# Altium schematic sheet PFC_CurrentSensor_v3.SchDoc
size A4
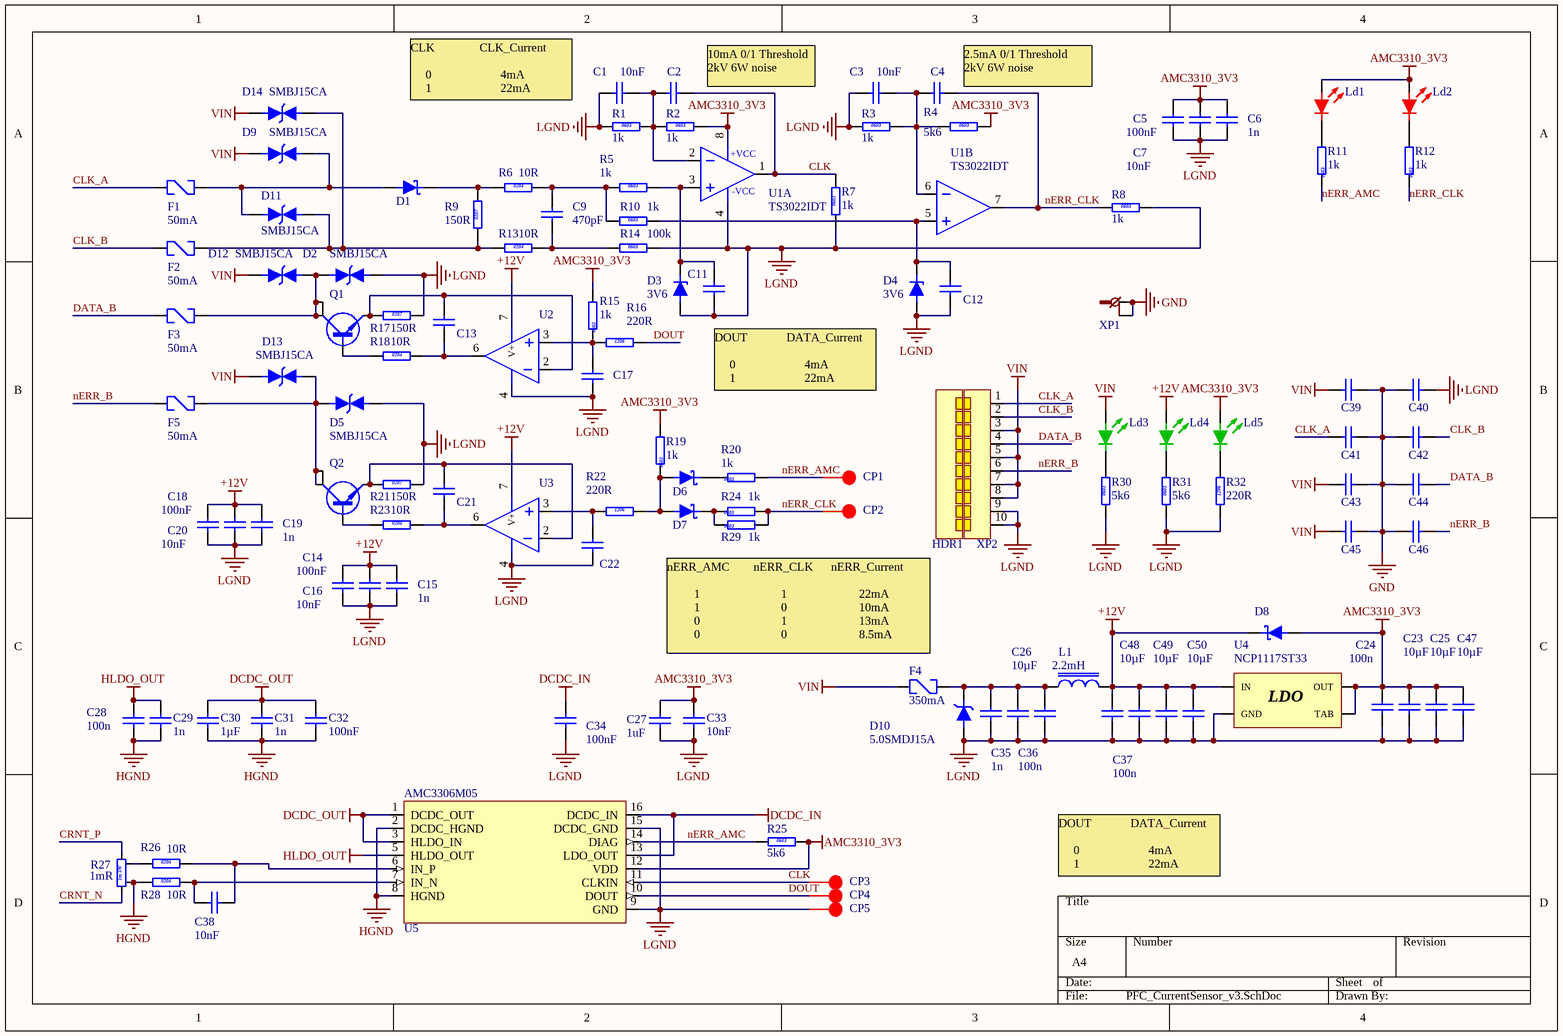
[diagram p0: PFC_CurrentSensor_v3.SchDoc]

## Parts
C1  10nF  [CAP1206]
C2  100p/100V/0603  [CAP0603]  (value not drawn)
C3  10nF  [CAP1206]
C4  100p/100V/0603  [CAP0603]  (value not drawn)
C5  100nF  [CAP1206]
C6  1n  [CAP0603]
C7  10nF  [CAP1206]
C9  470pF  [CAP1206]
C11  100p/100V/0603  [CAP0603]  (value not drawn)
C12  100p/100V/0603  [CAP0603]  (value not drawn)
C13  100p/100V/0603  [CAP0603]  (value not drawn)
C14  100nF  [CAP1206]
C15  1n  [CAP0603]
C16  10nF  [CAP1206]
C17  100p/100V/0603  [CAP0603]  (value not drawn)
C18  100nF  [CAP1206]
C19  1n  [CAP0603]
C20  10nF  [CAP1206]
C21  100p/100V/0603  [CAP0603]  (value not drawn)
C22  100p/100V/0603  [CAP0603]  (value not drawn)
C23  10µF  [CAP1210]
C24  100n  [CAP1812]
C25  10µF  [CAP1210]
C26  10µF  [CAP1210]
C27  1uF  [CAP1206]
C28  100n  [CAP1812]
C29  1n  [CAP1812]
C30  1µF  [CAP0603]
C31  1n  [CAP0603]
C32  100nF  [CAP0603]
C33  10nF  [CAP1206]
C34  100nF  [CAP0603]
C35  1n  [CAP1812]
C36  100n  [CAP1812]
C37  100n  [CAP1812]
C38  10nF  [CAP1206]
C39  470p/1kV/1812/C0G  [CAP1812]  (value not drawn)
C40  470p/1kV/1812/C0G  [CAP1812]  (value not drawn)
C41  470p/1kV/1812/C0G  [CAP1812]  (value not drawn)
C42  470p/1kV/1812/C0G  [CAP1812]  (value not drawn)
C43  470p/1kV/1812/C0G  [CAP1812]  (value not drawn)
C44  470p/1kV/1812/C0G  [CAP1812]  (value not drawn)
C45  470p/1kV/1812/C0G  [CAP1812]  (value not drawn)
C46  470p/1kV/1812/C0G  [CAP1812]  (value not drawn)
C47  10µF  [CAP1210]
C48  10µF  [CAP1210]
C49  10µF  [CAP1210]
C50  10µF  [CAP1210]
CP1  CONTROL PAD  [CONTROL PAD]  (value not drawn)
CP2  CONTROL PAD  [CONTROL PAD]  (value not drawn)
CP3  CONTROL PAD  [CONTROL PAD]  (value not drawn)
CP4  CONTROL PAD  [CONTROL PAD]  (value not drawn)
CP5  CONTROL PAD  [CONTROL PAD]  (value not drawn)
D1  B5819W/SOD123  [SOD123]  (value not drawn)
D2  SMBJ15CA  [SMB]
D3  3V6  [SMA]
D4  3V6  [SMA]
D5  SMBJ15CA  [SMB]
D6  B5819W/SOD123  [SOD123]  (value not drawn)
D7  B5819W/SOD123  [SOD123]  (value not drawn)
D8  B5819W/SOD123  [SOD123]  (value not drawn)
D9  SMBJ15CA  [SMB]
D10  5.0SMDJ15A  [SMC]
D11  SMBJ15CA  [SMB]
D12  SMBJ15CA  [SMB]
D13  SMBJ15CA  [SMB]
D14  SMBJ15CA  [SMB]
F1  50mA  [FUSE1206]
F2  50mA  [FUSE1206]
F3  50mA  [FUSE1206]
F4  350mA  [FUSE1206]
F5  50mA  [FUSE1206]
HDR1  2*5  [CON/MOLEX/2*5/2.00/FEMALE]  (value not drawn)
L1  2.2mH  [IND12.5X12.5MM]
Ld1  R/0603  [LED0603]  (value not drawn)
Ld2  R/0603  [LED0603]  (value not drawn)
Ld3  G/0603  [LED0603]  (value not drawn)
Ld4  G/0603  [LED0603]  (value not drawn)
Ld5  G/0603  [LED0603]  (value not drawn)
Q1  BCP56/SOT223L  [SOT223L]  (value not drawn)
Q2  BCP56/SOT223L  [SOT223L]  (value not drawn)
R1  1k  [RES0603]
R2  1k  [RES0603]
R3  1k  [RES0603]
R4  5k6  [RES0603]
R5  1k  [RES0603]
R6  10R  [MELF-0204]
R7  1k  [RES0603]
R8  1k  [RES0603]
R9  150R  [MELF-0207]
R10  1k  [RES0603]
R11  1k  [RES0603]
R12  1k  [RES0603]
R13  10R  [MELF-0204]
R14  100k  [RES0603]
R15  1k  [RES0603]
R16  220R  [RES1206]
R17  150R  [MELF-0207]
R18  10R  [MELF-0204]
R19  1k  [RES0603]
R20  1k  [RES0603]
R21  150R  [MELF-0207]
R22  220R  [RES1206]
R23  10R  [MELF-0204]
R24  1k  [RES0603]
R25  5k6  [RES0603]
R26  10R  [MELF-0204]
R27  1mR  [RES-5W-4terminals_CurrensSense]
R28  10R  [MELF-0204]
R29  1k  [RES0603]
R30  5k6  [RES0603]
R31  5k6  [RES0603]
R32  220R  [RES1206]
TRML1  CON/MOLEX/2*5/2.00/TERMILAL  [CON/MOLEX/2*5/2.00/TERMILAL]  (value not drawn)
TRML2  CON/MOLEX/2*5/2.00/TERMILAL  [CON/MOLEX/2*5/2.00/TERMILAL]  (value not drawn)
TRML3  CON/MOLEX/2*5/2.00/TERMILAL  [CON/MOLEX/2*5/2.00/TERMILAL]  (value not drawn)
TRML4  CON/MOLEX/2*5/2.00/TERMILAL  [CON/MOLEX/2*5/2.00/TERMILAL]  (value not drawn)
TRML5  CON/MOLEX/2*5/2.00/TERMILAL  [CON/MOLEX/2*5/2.00/TERMILAL]  (value not drawn)
TRML6  CON/MOLEX/2*5/2.00/TERMILAL  [CON/MOLEX/2*5/2.00/TERMILAL]  (value not drawn)
TRML7  CON/MOLEX/2*5/2.00/TERMILAL  [CON/MOLEX/2*5/2.00/TERMILAL]  (value not drawn)
TRML8  CON/MOLEX/2*5/2.00/TERMILAL  [CON/MOLEX/2*5/2.00/TERMILAL]  (value not drawn)
TRML9  CON/MOLEX/2*5/2.00/TERMILAL  [CON/MOLEX/2*5/2.00/TERMILAL]  (value not drawn)
TRML10  CON/MOLEX/2*5/2.00/TERMILAL  [CON/MOLEX/2*5/2.00/TERMILAL]  (value not drawn)
U1  TS3022IDT  [SO8_N]  (parts A,B of 2)
U2  TLV197QDGKRQ1  [MS-8]  (value not drawn)
U3  TLV197QDGKRQ1  [MS-8]  (value not drawn)
U4  NCP1117ST33  [SOT223L]
U5  AMC3306M05  [SOIC-16W]
XP1  CON/1*1/5mm/M/Faston  [LS1560]  (value not drawn)
XP2  2*5  [CON/MOLEX/2*5/2.00/SMT_MALE]  (value not drawn)

## Nets
+12V: C14.1 C15.1 C16.2 C18.1 C19.1 C20.2 C37.1 C48.1 C49.1 C50.1 D8.2(C) L1.2 Ld4.1 U2.7(V+) U3.7(V+) U4.3(IN)
AMC3310_3V3: C5.1 C6.1 C7.2 C23.1 C24.1 C25.1 C27.1 C33.1 C47.1 D8.1(A) Ld1.1 Ld2.1 Ld5.1 R2.1 R4.1 R15.1 R19.1 R25.1 U1.8(V+) U4.2(OUT) U4.4(TAB) U5.12(VDD)
DCDC_IN: C34.2 U5.13(LDO_OUT) U5.16(DCDC_IN)
DCDC_OUT: C30.1 C31.1 C32.2 U5.1(DCDC_OUT) U5.3(HLDO_IN)
GND: C39.2 C40.1 C41.2 C42.1 C43.2 C44.1 C45.2 C46.1 XP1.1(P$1) XP1.1A(P$2)
HGND: C28.2 C29.2 C30.2 C31.2 C32.1 R27.2(S1) R28.2 U5.2(DCDC_HGND) U5.8(HGND)
HLDO_OUT: C28.1 C29.1 U5.5(HLDO_OUT)
LGND: C1.2 C3.2 C5.2 C6.2 C7.1 C11.1 C12.1 C14.2 C15.2 C16.1 C17.2 C18.2 C19.2 C20.1 C22.2 C23.2 C24.2 C25.2 C26.2 C27.2 C33.2 C34.1 C35.2 C36.2 C37.2 C40.2 C47.2 C48.2 C49.2 C50.2 CP5.1 D2.1(A) D3.1(A) D4.1(A) D5.1(A) D10.1(A) R1.2 R3.2 R7.2 R8.1 R14.1 R17.1 R21.1 R30.2 R31.2 R32.2 U1.4(V-) U2.4(Vee) U3.4(Vee) U4.1(GND) U5.9(GND) U5.15(DCDC_GND) XP2.9 XP2.10
VIN: C39.1 C43.1 C45.1 D9.2(C) D12.1(A) D13.1(A) D14.2(C) F4.2 Ld3.1 XP2.3 XP2.5 XP2.7 XP2.8
CLK: C2.2 CP3.1 R7.1 U1.1(OUT1) U5.11(CLKIN)
CLK_A: C41.1 F1.2 XP2.1
CLK_B: C42.2 F2.2 XP2.2
CRNT_N: R27.1(C1)
CRNT_P: R27.4(C2)
DATA_B: C44.2 F3.2 XP2.4
DOUT: CP4.1 R16.1 U5.10(DOUT)
nERR_AMC: CP1.1 R11.2 R20.1 R25.2 U5.14(DIAG)
nERR_B: C46.2 F5.2 XP2.6
nERR_CLK: C4.2 CP2.1 R8.2 R12.2 R24.1 R29.1 U1.7(OUT2)
NetC1_1: C1.1 C2.1 R1.1 R2.2 U1.2(IN-1)
NetC3_1: C3.1 C4.1 R3.1 R4.2 U1.6(IN-2)
NetC9_1: C9.1 R5.2 R6.1 R10.2
NetC9_2: C9.2 R13.1 R14.2
NetC11_2: C11.2 D3.2(C) R5.1 U1.3(IN+1)
NetC12_2: C12.2 D4.2(C) R10.1 U1.5(IN+2)
NetC13_1: C13.1 R18.1 U2.6(OUT1)
NetC13_2: C13.2 Q1.3(E) R17.2 U2.2(IN-)
NetC17_1: C17.1 R15.2 R16.2 U2.3(IN+)
NetC21_1: C21.1 R23.1 U3.6(OUT1)
NetC21_2: C21.2 Q2.3(E) R21.2 U3.2(IN-)
NetC22_1: C22.1 R22.2 U3.3(IN+)
NetC26_1: C26.1 C35.1 C36.1 D10.2(C) F4.1 L1.1
NetC38_1: C38.1 R28.1 U5.7(IN_N)
NetC38_2: C38.2 R26.1 U5.6(IN_P)
NetD1_1: D1.1(A) D9.1(A) D11.2(C) F1.1
NetD1_2: D1.2(C) R6.2 R9.1
NetD2_2: D2.2(C) D12.2(C) F3.1 Q1.2(C) Q1.4(S)
NetD5_2: D5.2(C) D13.2(C) F5.1 Q2.2(C) Q2.4(S)
NetD6_1: D6.1(A) D7.1(A) R19.2 R22.1
NetD6_2: D6.2(C) R20.2
NetD7_2: D7.2(C) R24.2 R29.2
NetD11_1: D11.1(A) D14.1(A) F2.1 R9.2 R13.2
NetLd1_2: Ld1.2 R11.1
NetLd2_2: Ld2.2 R12.1
NetLd3_2: Ld3.2 R30.1
NetLd4_2: Ld4.2 R31.1
NetLd5_2: Ld5.2 R32.1
NetQ1_1: Q1.1(B) R18.2
NetQ2_1: Q2.1(B) R23.2
NetR26_2: R26.2 R27.3(S2)

## Notes on the sheet
- CLK               CLK_Current
  0                       4mA
  1                       22mA
- 10mA 0/1 Threshold
  2kV 6W noise
- (near C4) 2.5mA 0/1 Threshold
  2kV 6W noise
- DOUT             DATA_Current
  0                       4mA
  1                       22mA
- nERR_AMC        nERR_CLK      nERR_Current
  1                           1                        22mA
  1                           0                        10mA
  0                           1                        13mA
  0                           0                        8.5mA
- (in symbol Comp/TS3022/5V/38ns/SOIC-8, part A) +VCC; -VCC
- (in symbol LDO/NCP1117/3.3V/20V/1A/SOT223) LDO
- (in symbol R1m/5W/TH/4 Terminal) 1m 5W
- (in symbol R100/0.5%/0204) 0204
- (in symbol R102/0603) 0603
- (in symbol R104/0603) 0603
- (in symbol R151/0207) 0207
- (in symbol R221/1206) 1206
- (in symbol R562/0603) 0603

## Library data of the parts
C1 C3 C7 C16 C20 C33 C38 = C103/50V/1206: CAPACITOR UNPOLARIZED; Store D Other: lcsc C152841
C2 C4 C11-C13 C17 C21 C22 = C101/100V/0603: CAPACITOR UNPOLARIZED; Store B TME: C0603C101J1GAC; Store A Farnell: 1414602; Store C Mouser: 80-C0603C101J1G; Stock: ?
C5 C14 C18 = C104/50V/NP0/1206: CAPACITOR UNPOLARIZED; Store C Mouser: 810-C3216NP01H104J1A; Store D Other: *
C6 C15 C19 C31 = C102/25V/0603: CAPACITOR UNPOLARIZED; Store C Mouser: 80-C0603C102J3GAUTO; Stock: ?
C9 = C471/100V/1206/C0G: CAPACITOR UNPOLARIZED; Store A Farnell: 2320870; Store C Mouser: 710-885012008071; Stock: ?
C23 C25 C26 C47-C50 = C106/50V/1210: CAPACITOR UNPOLARIZED; Store B TME: C1210C106K5RAC; Store C Mouser: 80-C1210C106K5R; Stock: ?
C24 C28 C36 C37 = C104/1kV/1812: CAPACITOR UNPOLARIZED; Store D Other: lcsc C106147; Stock: ?
C27 = C105/100V/1206: CAPACITOR UNPOLARIZED; Store C Mouser: 80-C1206C105K1R
C29 C35 = C102/1000V/1812/X7R: CAPACITOR UNPOLARIZED; Store C Mouser: 80-C1812C102KDG; Stock: ?
C30 = C105/50V/0603: CAPACITOR UNPOLARIZED; Store D Other: JLCPCB CL10A105KB8NNNC; Store B TME: CL10A105KB8NNNC; Store A Farnell: 3013383; Store C Mouser: 581-06035D105MAT2A; Stock: ?
C32 C34 = C104/50V/0603: CAPACITOR UNPOLARIZED; Store D Other: JLCPCB CC0603KRX7R9BB104; Store B TME: 06035C104KAT2A; Store A Farnell: 1740621; Store C Mouser: 581-06035C104JAT2A; Stock: ?
C39-C46 = C471/1000V/1812/C0G: CAPACITOR UNPOLARIZED; Store C Mouser: 80-C1812C471JDG; Stock: ?
D1 D6-D8 = D/Schottky/B5819W/1A/40V/SOD123: SCHOTTKY BARRIER DIODE/1A/40V/SOD123; Store D Other: JLCPCB B5819W; Store B TME: MBR140SFT1G; Store A Farnell: 1773475; Store C Mouser: 833-B5819W-TP; Stock: ?
D2 D5 D9 D11-D14 = SUP/SMBJ15CA/SMB: TVS Diode; Store C Mouser: 652-SMBJ15CA; Stock: ?
D3 D4 = D/ZENER/3.6V/BZG05C3V6/SMA: Zener Diode; Store C Mouser: 78-BZG05C3V6-M3-08; Stock: ?
D10 = SUP/5.0SMDJ15A/SMC: TVS Diode; Store C Mouser: 652-5.0SMDJ15A; Store D Other: *; Stock: ?
F1-F3 F5 = FUSE_RESETTABLE/50mA/1206: Resettable Fuses - PPTC PTC 60V POLYFUSE SURF MOUNT 1206 0.05A; Store C Mouser: 576-1206L005/60WR; Store D Other: *; Stock: ?
F4 = FUSE_RESETTABLE/350mA/1206: Resettable Fuses - PPTC .35A RESETTABLE SMD FUSE; Store C Mouser: 650-NANOSMDC035F-2; Store D Other: *; Stock: ?
HDR1 = CON/MOLEX/2*5/2.00/FEMALE: Headers & Wire Housings 2.00 mm; Store C Mouser: 538-51110-1060; Stock: ?
L1 = L222/400mA/12.5*12.5: INDUCTOR SMD; Store C Mouser: 652-SRR1208-222KL; Store D Other: *; Stock: ?
Ld1 Ld2 = LED/R/0603: LIGHT EMITTING DIODE; Store D Other: lcsc C84263; Stock: ?
Ld3-Ld5 = LED/G/0603: LIGHT EMITTING DIODE; Store D Other: JLCPCB 19-217/GHC-YR1S2/3T; Stock: ?
Q1 Q2 = NPN_BCP56/SOT223L: NPN SMD; Store B TME: BCP56-16.115 Nexperia(BCP56-16.115); Store C Mouser: 771-BCP56-16TF Nexperia(BCP56-16TF); Store D Other: *; Stock: ?
R1-R3 R5 R7 R8 R10-R12 R15 R19 R20 R24 R29 = R102/0603: RESISTOR SMD; Store A Farnell: 3223635; Store C Mouser: 652-CR0603AFX1001EAS; Stock: ?
R4 R25 R30 R31 = R562/0603: RESISTOR SMD; Store C Mouser: 71-CRCW0603-5.6K-E3; Stock: ?
R6 R13 R18 R23 R26 R28 = R100/0.5%/0204: RESISTOR SMD; Store C Mouser: 71-SMM02040E1009DB30; Store D Other: *; Stock: ?
R9 R17 R21 = R151/0207: RESISTOR SMD MELF; Store C Mouser: 279-SMAA0207FTDT150R; Stock: ?
R14 = R104/0603: RESISTOR SMD; Store C Mouser: 652-CR0603-FX-103ELF; Stock: ?
R16 R22 R32 = R221/1206: RESISTOR SMD; Store D Other: lcsc C125949; Stock: ?
R27 = R1m/5W/TH/4 Terminal: Current Sense Resistors - Through Hole 5W 0.001 Ohms 0.5%; Store C Mouser: 588-CS5DR001E; Stock: ?
TRML1-TRML10 = CON/MOLEX/2*5/2.00/TERMILAL: Headers & Wire Housings 2.00 mm; Store C Mouser: 538-50394-8200; Stock: ?
U1 = Comp/TS3022/5V/38ns/SOIC-8: Rail-to-rail 1.8 V high-speed dual comparator; Store A Farnell: 3129694; Store C Mouser: 511-TS3022IDT; Stock: ?
U2 U3 = OpAmp/TLV197QDGKRQ1/40V/10mA/20V/us/10MHz/VSSOP-8: Operational Amplifiers - Op Amps Automotive, single channel, high-voltage, precision, RRIO op amp 8-VSSOP -40 to 125; Store C Mouser: 595-TLV197QDGKRQ1; Stock: ?
U4 = LDO/NCP1117/3.3V/20V/1A/SOT223: LDO Voltage Regulators 3.3V 1A Positive; Store C Mouser: 863-NCP1117ST33T3G; Stock: ?
U5 = CurrentSensor/AMC3306M05DWE/SigmaDelta_ADC/50mV/SOIC16W: Analog to Digital Converters - ADC High-precision, +/-50-mV input, reinforced isolated modulator with integrated DC/DC converter 16-SOIC -40 to 125 Amplifier  With Integrated DC/DC Converter; Store C Mouser: 595-AMC3306M05DWE; Stock: ?
XP1 = CON/1*1/5mm/M/Faston: Terminals GDS-FLACHSTECK 6.3; Store C Mouser: 571-726386-2; Store D Other: *; Stock: ?
XP2 = CON/MOLEX/2*5/2.00/SMT_MALE: Headers & Wire Housings 2.00 mm; Store C Mouser: 538-87832-1016; Stock: ?
CP1-CP5 = CONTROL PAD: Store: *; Store Symbol: *; Manufacturer Name: *; Manufacturer No.: *; Nominal Comment: *